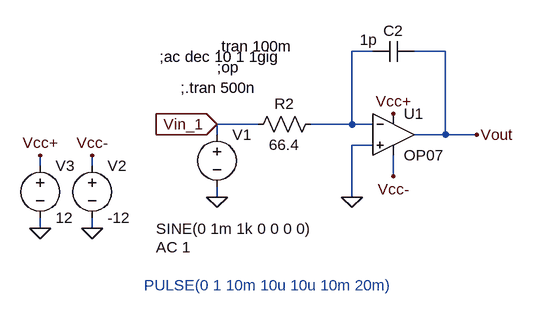
[diagram p0: schematic Delay_cell_4.asc]
Delay_cell_4.asc, the LTspice schematic file:
Version 4
SHEET 1 1056 680
WIRE 80 0 48 0
WIRE 192 0 144 0
WIRE -96 112 -160 112
WIRE 48 112 48 0
WIRE 48 112 -16 112
WIRE 80 112 48 112
WIRE -160 128 -160 112
WIRE 192 128 192 0
WIRE 192 128 144 128
WIRE 240 128 192 128
WIRE 80 144 48 144
WIRE -432 176 -432 160
WIRE -352 176 -352 160
WIRE 112 192 112 160
WIRE -160 224 -160 208
WIRE 48 224 48 144
WIRE -432 272 -432 256
WIRE -352 272 -352 256
FLAG -160 112 Vin_1
IOPIN -160 112 In
FLAG 48 224 0
FLAG -160 224 0
FLAG 112 96 Vcc+
FLAG 112 192 Vcc-
FLAG -352 272 0
FLAG -432 272 0
FLAG -352 160 Vcc-
FLAG -432 160 Vcc+
FLAG 240 128 Vout
SYMBOL res 0 96 R90
WINDOW 0 0 56 VBottom 2
WINDOW 3 32 56 VTop 2
SYMATTR InstName R2
SYMATTR Value 66.4
SYMBOL voltage -160 112 R0
WINDOW 3 -94 161 Left 2
WINDOW 123 -94 189 Left 2
WINDOW 39 0 0 Left 0
SYMATTR Value SINE(0 1m 1k 0 0 0 0)
SYMATTR Value2 AC 1
SYMATTR InstName V1
SYMBOL cap 144 -16 R90
WINDOW 0 0 32 VBottom 2
WINDOW 3 -18 70 VTop 2
SYMATTR InstName C2
SYMATTR Value 1p
SYMBOL voltage -352 160 R0
WINDOW 123 0 0 Left 0
WINDOW 39 0 0 Left 0
SYMATTR InstName V2
SYMATTR Value -12
SYMBOL voltage -432 160 R0
WINDOW 123 0 0 Left 0
WINDOW 39 0 0 Left 0
SYMATTR InstName V3
SYMATTR Value 12
SYMBOL OpAmps\\OP07 112 64 R0
SYMATTR InstName U1
TEXT -160 24 Left 2 !;op
TEXT -160 -8 Left 2 !.tran 100m
TEXT -272 360 Left 2 ;PULSE(0 1 10m 10u 10u 10m 20m)
TEXT -248 8 Left 2 !;ac dec 10 1 1gig
TEXT -216 56 Left 2 !;.tran 500n

The netlist it stands for:
* Delay_cell_4.asc
R2 N001 Vin_1 66.4
V1 Vin_1 0 SINE(0 1m 1k 0 0 0 0) AC 1
C2 Vout N001 1p
V2 Vcc- 0 -12
V3 Vcc+ 0 12
XU1 0 N001 Vcc+ Vcc- Vout LT1001  ; OP07, pins In+ In- V+ V- OUT
;op
.tran 100m
* PULSE(0 1 10m 10u 10u 10m 20m)
;ac dec 10 1 1gig
;.tran 500n
.lib LTC.lib
.backanno
.end